# Altium schematic sheet batt_switch.SchDoc
size A2
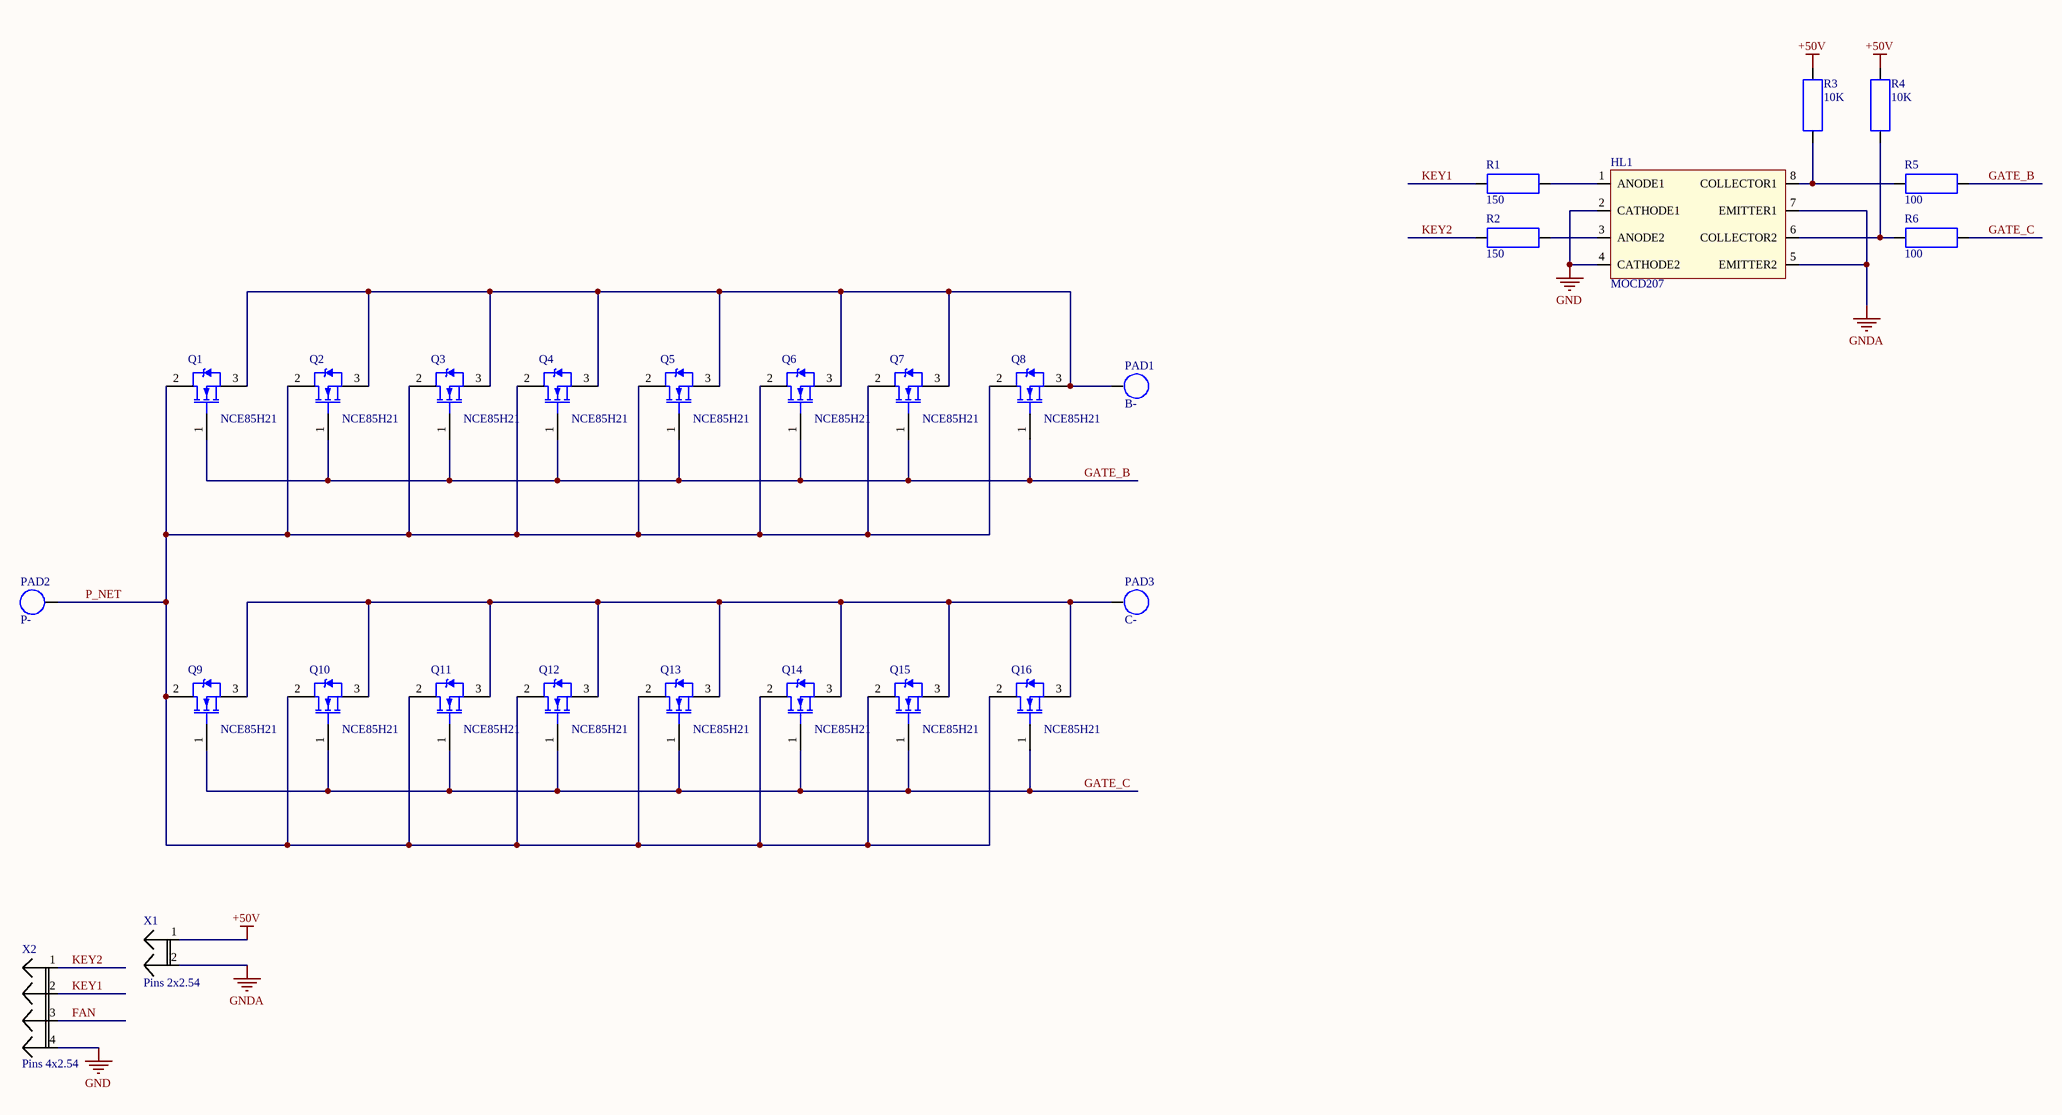
[diagram p0: batt_switch.SchDoc]

## Parts
HL1  MOCD207  [SO8]
PAD1  B-  [PAD]
PAD2  P-  [PAD]
PAD3  C-  [PAD]
Q1  NCE85H21  [NCE85H21]
Q2  NCE85H21  [NCE85H21]
Q3  NCE85H21  [NCE85H21]
Q4  NCE85H21  [NCE85H21]
Q5  NCE85H21  [NCE85H21]
Q6  NCE85H21  [NCE85H21]
Q7  NCE85H21  [NCE85H21]
Q8  NCE85H21  [NCE85H21]
Q9  NCE85H21  [NCE85H21]
Q10  NCE85H21  [NCE85H21]
Q11  NCE85H21  [NCE85H21]
Q12  NCE85H21  [NCE85H21]
Q13  NCE85H21  [NCE85H21]
Q14  NCE85H21  [NCE85H21]
Q15  NCE85H21  [NCE85H21]
Q16  NCE85H21  [NCE85H21]
R1  150  [R0805]
R2  150  [R0805]
R3  10K  [R0805]
R4  10K  [R0805]
R5  100  [R0805]
R6  100  [R0805]
X1  Pins 2x2.54  [Pins 2x2.54]
X2  Pins 4x2.54  [Pins 4x2.54]

## Nets
+50V: R3.2 R4.2 X1.1
GND: HL1.2(CATHODE1) HL1.4(CATHODE2) X2.4
GNDA: HL1.5(EMITTER2) HL1.7(EMITTER1) X1.2
FAN: X2.3
GATE_B: Q1.1(G) Q2.1(G) Q3.1(G) Q4.1(G) Q5.1(G) Q6.1(G) Q7.1(G) Q8.1(G) R5.2
GATE_C: Q9.1(G) Q10.1(G) Q11.1(G) Q12.1(G) Q13.1(G) Q14.1(G) Q15.1(G) Q16.1(G) R6.2
KEY1: R1.1 X2.2
KEY2: R2.1 X2.1
P_NET: PAD2.1 Q1.2(D) Q2.2(D) Q3.2(D) Q4.2(D) Q5.2(D) Q6.2(D) Q7.2(D) Q8.2(D) Q9.2(D) Q10.2(D) Q11.2(D) Q12.2(D) Q13.2(D) Q14.2(D) Q15.2(D) Q16.2(D)
NetHL1_1: HL1.1(ANODE1) R1.2
NetHL1_3: HL1.3(ANODE2) R2.2
NetHL1_6: HL1.6(COLLECTOR2) R4.1 R6.1
NetHL1_8: HL1.8(COLLECTOR1) R3.1 R5.1
NetPAD1_1: PAD1.1 Q1.3(S) Q2.3(S) Q3.3(S) Q4.3(S) Q5.3(S) Q6.3(S) Q7.3(S) Q8.3(S)
NetPAD3_1: PAD3.1 Q9.3(S) Q10.3(S) Q11.3(S) Q12.3(S) Q13.3(S) Q14.3(S) Q15.3(S) Q16.3(S)

## Library data of the parts
HL1 = Optopara_MOCD207
PAD1-PAD3 = PAD
R1-R6 = Resistor